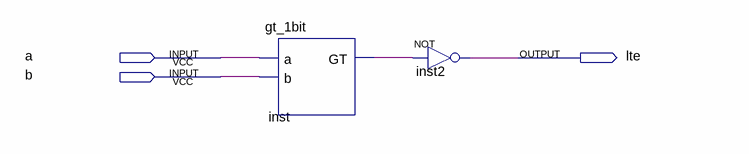
[diagram p0: schematic sheet]
// Quartus schematic lte_1bit.bdf as structural Verilog: 2 symbols, 3 pins
module lte_1bit (
  input  a,
  input  b,
  output lte
);

  wire inst_gt;

  gt_1bit inst (.a(a), .b(b), .GT(inst_gt));
  not inst2 (lte, inst_gt);
endmodule
